# EAGLE design CH-THB (EAGLE 9.6.2)
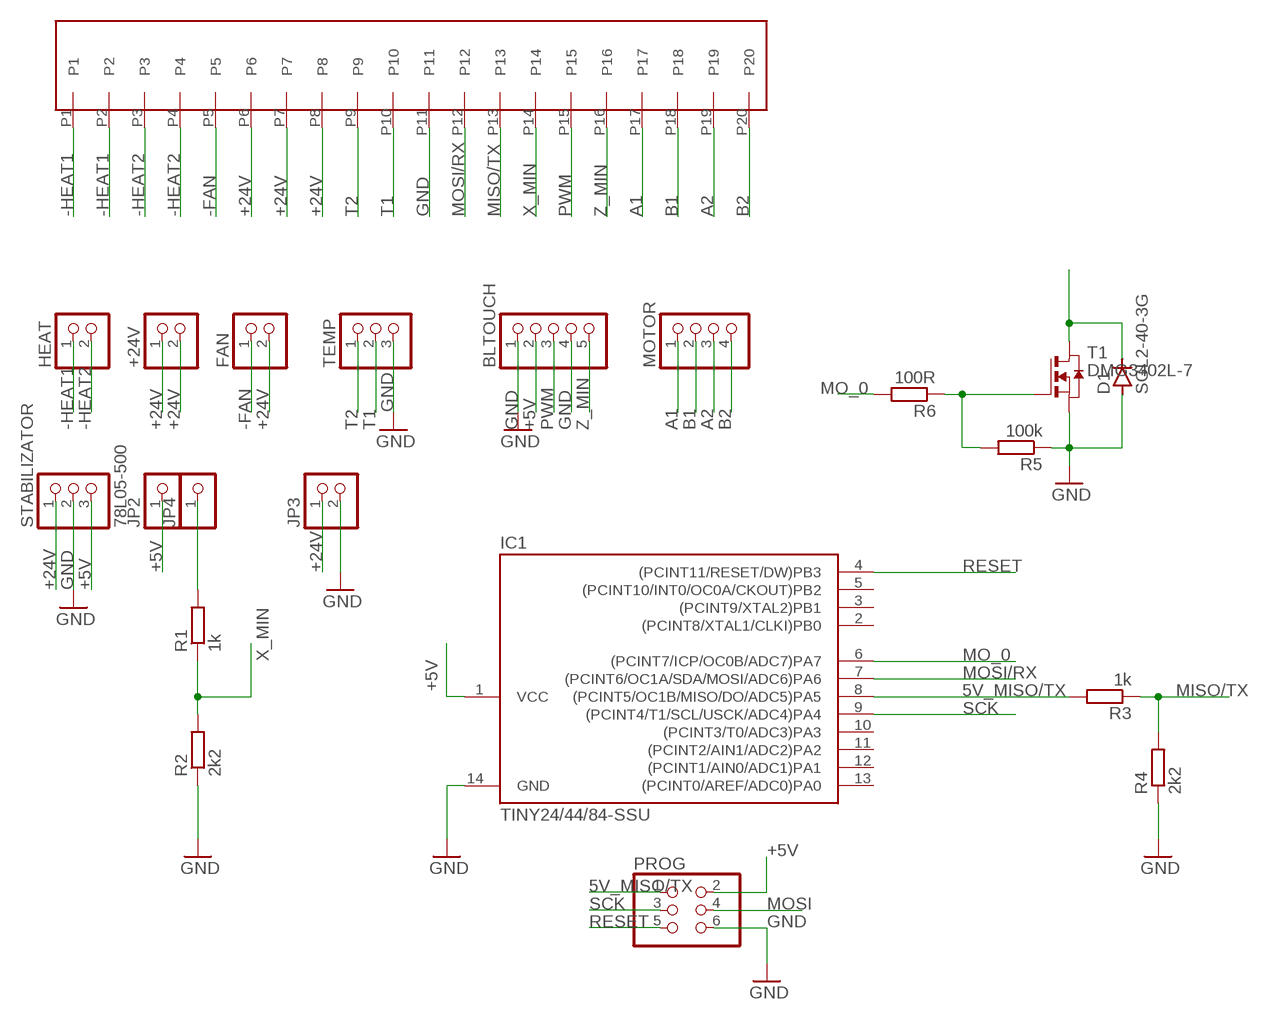
[diagram p0: schematic, sheet 1]

## Parts
+24V  PINHD-1X2/LONG  [1X02]
BLTOUCH  PINHD-1X5/LONG  [1X05]
D1  SGL2-40-3G  D-SOD-80  [SOD80]
FAN  PINHD-1X2/LONG  [1X02]
HEAT  PINHD-1X2/LONG  [1X02]
IC1  TINY24/44/84-SSU  [SOIC14]
JP2  PINHD-1X1/OCT  [1X01/OCT]
JP3  PINHD-1X2/OCT  [1X02/OCT]
JP4  PINHD-1X1/OCT  [1X01/OCT]
MOTOR  PINHD-1X4/LONG  [1X04]
PROG  PINHD-2X3/OCT  [2X03]
R1  1k  R-EU_R0603  [R0603]
R2  2k2  R-EU_R0603  [R0603]
R3  1k  R-EU_R0603  [R0603]
R4  2k2  R-EU_R0603  [R0603]
R5  100k  R-EU_R0603  [R0603]
R6  100R  R-EU_R0603  [R0603]
STABILIZATOR  78L05-500  PINHD-1X3/OCT  [1X03/OCT]
T1  DMG3402L-7  NMOSSOT23  [SOT-23]
TEMP  PINHD-1X3/OCT  [1X03/OCT]
U$1  PL20  [PL20]

## Nets
5V_MISO/TX: IC1.8((PCINT5/OC1B/MISO/DO/ADC5)PA5) PROG.1 R3.2
+5V: BLTOUCH.2 IC1.1(VCC) JP2.1 PROG.2 STABILIZATOR.3
+24V: +24V.1 +24V.2 FAN.2 JP3.1 STABILIZATOR.1 U$1.P6 U$1.P7 U$1.P8
-FAN: FAN.1 U$1.P5
-HEAT1: HEAT.1 U$1.P1 U$1.P2
-HEAT2: HEAT.2 U$1.P3 U$1.P4
A1: MOTOR.1 U$1.P17
A2: MOTOR.3 U$1.P19
B1: MOTOR.2 U$1.P18
B2: MOTOR.4 U$1.P20
GND: BLTOUCH.1 BLTOUCH.4 D1.2(A) IC1.14(GND) JP3.2 PROG.6 R2.1 R4.1 R5.1 STABILIZATOR.2 T1.2(S) TEMP.3 U$1.P11
MISO/TX: R3.1 R4.2 U$1.P13
MO_0: IC1.6((PCINT7/ICP/OC0B/ADC7)PA7) R6.2
MOSI: PROG.4
MOSI/RX: IC1.7((PCINT6/OC1A/SDA/MOSI/ADC6)PA6) U$1.P12
N$1: JP4.1 R1.2
N$3: R5.2 R6.1 T1.3(G)
N$4: D1.1(C) T1.1(D)
PWM: BLTOUCH.3 U$1.P15
RESET: IC1.4((PCINT11/RESET/DW)PB3) PROG.5
SCK: IC1.9((PCINT4/T1/SCL/USCK/ADC4)PA4) PROG.3
T1: TEMP.2 U$1.P10
T2: TEMP.1 U$1.P9
X_MIN: R1.1 R2.2 U$1.P14
Z_MIN: BLTOUCH.5 U$1.P16
Unconnected: IC1.2((PCINT8/XTAL1/CLKI)PB0) IC1.3((PCINT9/XTAL2)PB1) IC1.5((PCINT10/INT0/OC0A/CKOUT)PB2) IC1.10((PCINT3/T0/ADC3)PA3) IC1.11((PCINT2/AIN1/ADC2)PA2) IC1.12((PCINT1/AIN0/ADC1)PA1) IC1.13((PCINT0/AREF/ADC0)PA0)

## Library data of the parts
+24V FAN HEAT JP3 = pinhead_v2:PINHD-1X2: PIN HEADER
BLTOUCH = pinhead_v2:PINHD-1X5: PIN HEADER
D1 = semicon-smd-ipc:D-: DIODE unfilled
IC1 = avr-4:TINY24/44/84
JP2 JP4 = pinhead_v2:PINHD-1X1: PIN HEADER
MOTOR = pinhead_v2:PINHD-1X4: PIN HEADER
PROG = pinhead_v2:PINHD-2X3: PIN HEADER
R1-R6 = rcl:R-EU_: RESISTOR, European symbol; SPICEPREFIX: R
STABILIZATOR TEMP = pinhead_v2:PINHD-1X3: PIN HEADER
T1 = zetex:NMOSSOT23: MOS FET; OC_FARNELL: unknown; OC_NEWARK: unknown
U$1 = Plochy_kabel_Pajeni:PL20

## Board
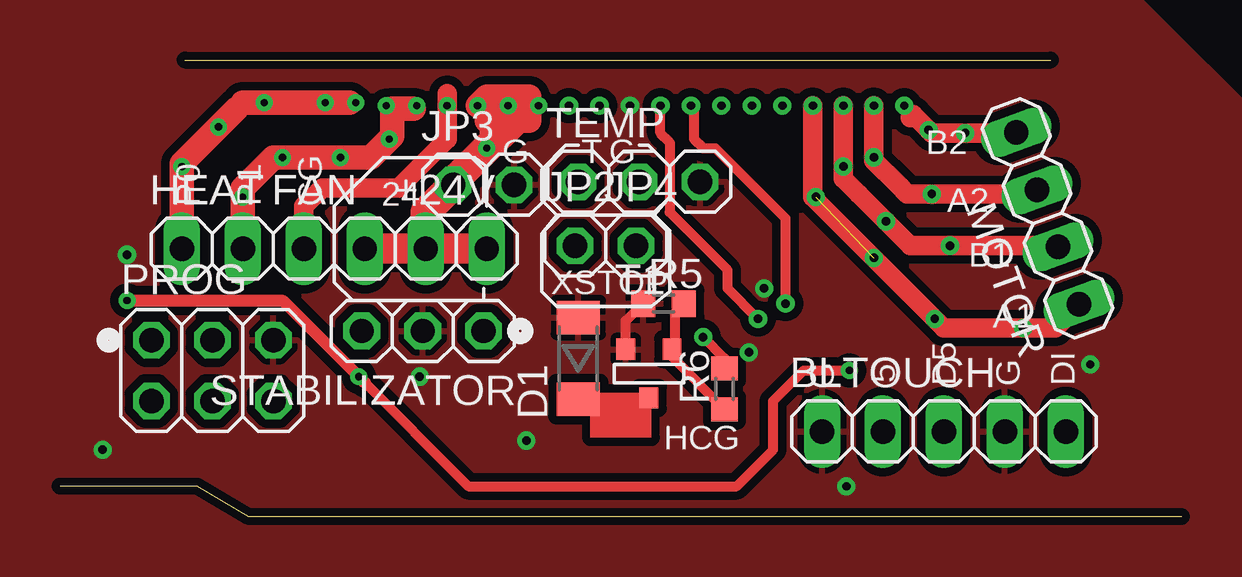
[diagram p1: board, top side]
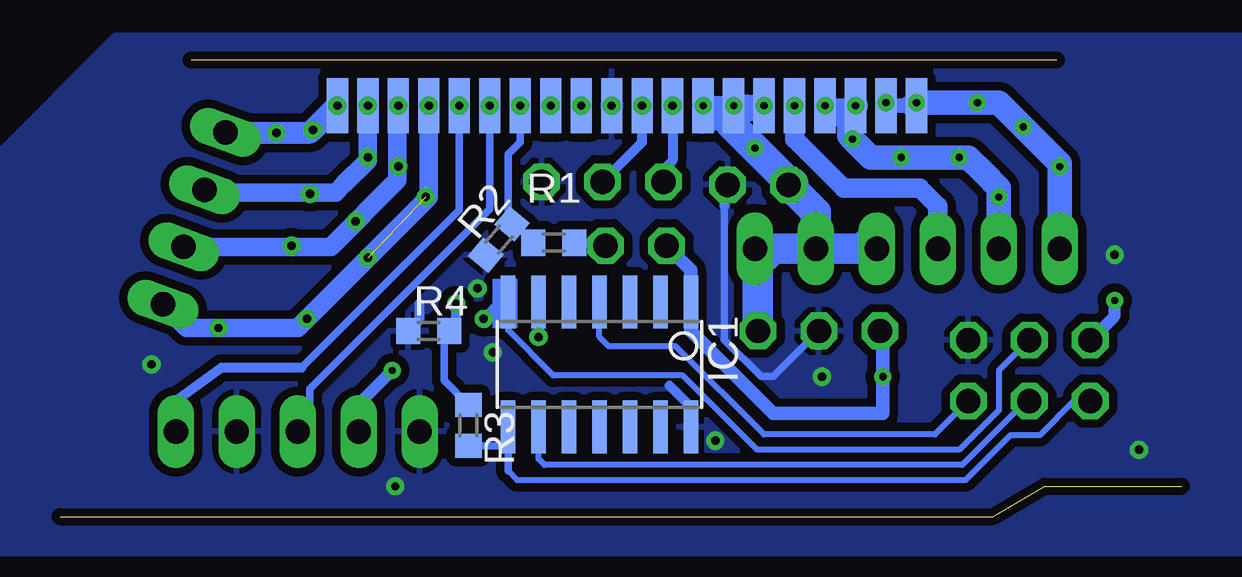
[diagram p2: board, bottom side, seen from below]

Size 46.74 x 19.05 mm. Coordinates in mm from the lower left corner, seen from the top.
Outline: 5.21,19.05 41.27,19.05
Outline: 46.74,0 7.87,0 5.71,1.27 0,1.27
Copper layers (1*16): Top 0.035mm / dielectric 1.5mm / Bottom 0.035mm
Design rules "default *": minimum track width 6mil, minimum drill 0.35mm, track to track 6mil, track to pad 6mil, pad to pad 6mil, via to via 6mil, smd to smd 6mil, copper to edge 10mil, drill to drill 6mil, minimum pad ring 10mil, minimum via ring 8mil, stop-mask expansion 4mil, vias tented up to drill 0mil, thermal gap 10mil

### Footprints (pad centres in the part's own frame; a part is rotated, then mirrored left to right if it is on the bottom)
1X02 = drill 1.016 long: 1 -1.27,0; 2 1.27,0
1X05 = drill 1.016 long: 1 -5.08,0; 2 -2.54,0; 3 0,0; 4 2.54,0; 5 5.08,0
SOD80 = smd 1.4 x 1.8: 1 -1.7,0; 2 1.7,0
SOIC14 = smd 0.61 x 2.21: 1 -3.81,-2.603; 2 -2.54,-2.603; 3 -1.27,-2.603; 4 0,-2.603; 5 1.27,-2.603; 6 2.54,-2.603; 7 3.81,-2.603; 8 3.81,2.603; 9 2.54,2.603; 10 1.27,2.603; 11 0,2.603; 12 -1.27,2.603; 13 -2.54,2.603; 14 -3.81,2.603
1X01/OCT = drill 1.016 octagon: 1 0,0
1X02/OCT = drill 1.016 octagon: 1 -1.27,0; 2 1.27,0
1X04 = drill 1.016 long: 1 -3.81,0; 2 -1.27,0; 3 1.27,0; 4 3.81,0
2X03 = drill 1.016 octagon: 1 -2.54,-1.27; 2 -2.54,1.27; 3 0,-1.27; 4 0,1.27; 5 2.54,-1.27; 6 2.54,1.27
R0603 = smd 1 x 1.1: 1 -0.85,0; 2 0.85,0
1X03/OCT = drill 1.016 octagon: 1 -2.54,0; 2 0,0; 3 2.54,0
SOT-23 = smd 0.787 x 0.889: 1 0.025,-1.016; 2 -0.94,1.016; 3 0.991,1.016
PL20 = smd 0.889 x 2.286: P1 -11.43,0; P2 -10.16,0; P3 -8.89,0; P4 -7.62,0; P5 -6.35,0; P6 -5.08,0; P7 -3.81,0; P8 -2.54,0; P9 -1.27,0; P10 0,0; P11 1.27,0; P12 2.54,0; P13 3.81,0; P14 5.08,0; P15 6.35,0; P16 7.62,0; P17 8.89,0; P18 10.16,0; P19 11.43,0; P20 12.7,0

### Placement (x,y rotation side)
+24V  16.51,11.18 0 top
BLTOUCH  36.83,3.56 0 top
D1  21.59,6.6 90 top
FAN  11.43,11.18 0 top
HEAT  6.35,11.18 0 top
IC1  24.26,6.35 180 bottom
JP2  21.46,11.3 0 top
JP3  17.65,13.84 0 top
JP4  24,11.3 0 top
MOTOR  41.15,12.45 110 top
PROG  6.35,6.1 0 top
R1  26.16,11.43 0 bottom
R2  28.45,11.56 50 bottom
R3  29.72,3.81 270 bottom
R4  31.37,7.75 0 bottom
R5  25.15,8.89 0 top
R6  27.69,5.33 90 top
STABILIZATOR  15.11,7.75 180 top
T1  24.51,5.97 0 top
TEMP  24.13,13.97 0 top
U$1  22.48,17.14 180 bottom

### Tracks (layer width: path | path; a pad name or v marks a point on that pad's centre or on a via)
5V_MISO/TX
  Bottom 0.254: IC1.8 28.07,4.7 | PROG.1 4.5,4.83 5.92,3.4 7.14,3.4 9.02,1.52 27.69,1.52 28.07,1.9
  Bottom 0.305: 28.07,1.9 28.07,2.79 | 28.07,2.79 IC1.8 | R3.2 28.23,2.96 28.07,2.79
+5V  (via drill 0.3)
  Top 0.406: v12.45,5.84 17.02,1.27 28.19,1.27 29.72,2.79 29.72,4.83 30.99,6.1 v32.89,6.1
  Top 0.508: 12.7,5.59 v12.45,5.84 9.27,9.02 v2.79,9.02
  Bottom 0.254: 20.45,7.75 IC1.1 20.32,9.08
  Bottom 0.508: STABILIZATOR.3 12.45,7.62 | v32.89,6.1 34.29,4.7 BLTOUCH.2 | PROG.2 2.79,8.38 v2.79,9.02
  Bottom 0.559: 12.45,7.62 v12.45,5.84 12.45,4.32 17.02,4.32 20.45,7.75 | IC1.1 20.45,10.29 JP2.1
+24V  (via drill 0.3)
  Top 0.61: U$1.P6 18.03,17.14 18.8,16.38 19.05,16.64 | v17.78,15.37 17.78,16.51 17.78,16.64
  Top 1.016: U$1.P6 17.78,17.53 19.56,17.53 19.56,16.51 17.78,16.51
  Top 1.27: +24V.1 15.24,12.7 JP3.1 16.38,13.97 v17.78,15.37 18.8,16.38 | FAN.2 +24V.1 | +24V.1 +24V.2
  Bottom 0.254: JP3.1 16.26,13.97 16.19,13.91
  Bottom 0.559: 18.6,17.07 U$1.P7 18.67,17.18 18.77,17.27 | 18.6,17.07 18.6,16.73 | U$1.P8 19.87,17.07 18.6,17.07 | U$1.P6 18.54,17.14 | +24V.1 17.02,11.18
  Bottom 0.813: 19.96,16.38 18.6,16.73 17.54,17 U$1.P6 18.77,17.27 | 18.54,17.14 U$1.P7 U$1.P8
  Bottom 1.27: +24V.2 15.75,11.18 | 17.02,11.18 17.29,10.9 17.65,11.74 STABILIZATOR.1 | 18.8,16.38 v17.78,15.37 16.32,13.91 | 16.32,13.91 16.45,13.91 15.24,12.7 +24V.1 13.34,11.18 12.7,11.81 | 16.32,13.91 16.19,13.91
  other vias: 17.4,17.14 18.67,17.14 19.94,17.14
-FAN  (via drill 0.3)
  Top 0.813: FAN.1 10.16,12.95 10.92,13.72 14.1,13.72 16.13,15.75 U$1.P5 16.13,17.65
  Bottom 0.813: FAN.1 10.16,12.95 10.92,13.72 14.09,13.72 16.13,15.76 U$1.P5
  other vias: 16.13,17.14
-HEAT1  (via drill 0.3)
  Top 1.016: HEAT.1 5.08,13.46 v5.08,14.61 5.08,14.73 5.84,15.49 v6.6,16.26 7.37,17.02 | 7.62,17.27 v8.51,17.27 9.78,17.27 v11.05,17.27 12.07,17.27
  Bottom 0.61: U$1.P2 U$1.P1
  Bottom 0.813: U$1.P1 11.35,17.17 10.56,17.27
  Bottom 1.016: HEAT.1 5.08,13.46 v5.08,14.61 5.08,14.74 7.62,17.27 v8.51,17.27 9.78,17.27 10.56,17.27
-HEAT2  (via drill 0.3)
  Top 1.016: HEAT.2 v7.62,13.34 7.62,13.72 8.26,14.35 8.89,14.99 v9.27,14.99 10.54,14.99 v11.68,14.99 12.83,14.99 12.95,14.99 v13.72,15.75 13.84,15.88 13.84,17.02 14.73,17.02
  Bottom 0.152: U$1.P4 14.86,17.05 14.6,16.79
  Bottom 0.61: 13.85,16.56 14.6,16.79 | 15.03,16.98 U$1.P4 U$1.P3
  Bottom 1.016: 13.85,16.56 13.85,15.89 v13.72,15.75 12.95,14.99 12.83,14.99 v11.68,14.99 10.54,14.99 v9.27,14.99 8.89,14.99 8.26,14.35 7.62,13.72 v7.62,13.34 HEAT.2 | U$1.P3 13.94,16.79 14.6,16.79
  other vias: 13.59,17.14 14.86,17.14
A1  (via drill 0.35)  (1 unrouted)
  Top 0.813: MOTOR.1 41.46,7.87 36.83,7.87 31.37,13.34 U$1.P17
  Bottom 0.762: U$1.P17 31.37,15.11 31.37,13.34 32.64,12.07 v33.91,10.79 35.18,9.53 v36.45,8.26 36.83,7.87 37.97,7.87 v40.13,7.87 41.46,7.87 MOTOR.1
  other vias: 31.37,17.14 31.5,13.34
A2  (via drill 0.35)
  Top 0.813: U$1.P19 33.91,16.51 33.91,15.75 33.91,14.86 34.92,13.84 35.31,13.46 v36.32,13.46 37.85,13.46 40.54,13.46 MOTOR.3
  Bottom 0.762: U$1.P19 v33.91,14.99 33.91,14.86 34.92,13.84 35.26,13.51 40.59,13.51 MOTOR.3
  other vias: 33.91,17.14
B1  (via drill 0.35)
  Top 0.813: U$1.P18 v32.64,14.61 32.64,14.1 33.27,13.46 v34.42,12.32 35.43,11.3 35.56,11.3 v37.08,11.3 39.12,11.3 40.89,11.3 40.89,10.92
  Bottom 0.762: U$1.P18 32.68,17.11 32.68,14.04 35.46,11.25 MOTOR.2
  other vias: 32.64,17.14
B2  (via drill 0.35)
  Top 0.813: MOTOR.4 39.82,16 v37.72,16 36.32,16 v36.2,16.13 35.56,16.76 35.43,16.64
  Bottom 0.914: U$1.P20 v36.2,16.13 36.3,16.03 MOTOR.4
  other vias: 35.18,17.14
GND  (via drill 0.35)
  Top 0.406: T1.2 23.57,8.17 R5.1
  Bottom 0.305: 19.05,12.95 19.05,7.37 17.53,5.84 17.02,5.84 STABILIZATOR.2
  Bottom 0.406: IC1.14 20.45,4.57 21.34,5.46 | R4.1 31.75,8.22 31.75,8.89 | 19.05,12.95 19.05,13.72 JP3.2
  other vias: 23.75,17.14 28.7,6.86 14.99,5.84 2.79,10.92 42.93,6.35 19.43,3.17 29.34,9.53 32.77,1.27 1.78,2.79
  pour Bottom (isolate 0.356): -3.81,-0.25 -3.81,20.07 44.45,20.07 49.53,14.99 49.53,-1.52 -2.54,-1.52
  pour Top (isolate 0.356): -4.83,21.59 -4.83,-2.29 -4.32,-2.79 50.04,-2.79 51.05,-1.78 51.05,15.49 44.45,22.1 -4.83,22.1
MISO/TX  (via drill 0.35)
  Top 0.406: U$1.P13 26.42,17.02 26.42,15.75 26.8,15.37 27.3,15.37 30.23,12.45 v30.23,8.89
  Bottom 0.305: R3.1 30.73,5.68 30.73,7.33 30.52,7.54 R4.2
  Bottom 0.406: R4.2 30.23,8.04 v30.23,8.89
  other vias: 26.29,17.14
MO_0  (via drill 0.35)
  Top 0.406: v26.8,7.49 27.69,6.6 R6.2
  Bottom 0.406: IC1.6 v26.8,7.49 26.67,7.37
MOSI
  Bottom 0.254: PROG.4 7.62,6.1 7.62,4.45 9.27,2.79 17.69,2.79 20.79,5.89 26.18,5.89 28.07,7.78
MOSI/RX  (via drill 0.35)
  Top 0.406: v29.08,8.26 27.81,9.53 27.81,10.29 25.4,12.7 25.4,15.62 25.02,16 U$1.P12
  Bottom 0.406: IC1.7 28.38,8.95 v29.08,8.26
  other vias: 25.02,17.14
N$1
  Bottom 0.305: JP4.1 24.68,11.3 24.8,11.43 R1.2
N$2  (via drill 0.3)
  other vias: 12.32,17.27
N$3
  Top 0.406: R6.1 25.5,6.67 T1.3 25.5,7.24 25.62,7.35 25.62,8.51 R5.2
N$4
  Top 0.406: D1.1 21.54,4.95 T1.1 23.88,4.29
PWM  (via drill 0.35)
  Bottom 0.305: BLTOUCH.3 36.32,4.06 36.32,5.33 28.83,12.83 U$1.P15
  Bottom 0.406: BLTOUCH.3 36.83,4.26
  other vias: 28.83,17.14
RESET
  Bottom 0.254: PROG.5 10.29,3.43 17.4,3.43 21.08,7.11 23.88,7.11 24.26,7.49 IC1.4
SCK
  Bottom 0.254: PROG.3 6.48,4.83 9.14,2.16 26.54,2.16 26.8,2.41 IC1.9
T1  (via drill 0.35)
  Bottom 0.406: TEMP.2 22.48,15.62 U$1.P10
  other vias: 22.48,17.14
T2  (via drill 0.35)
  Bottom 0.406: TEMP.1 21.59,14.48 21.21,14.86 U$1.P9
  other vias: 21.21,17.14
X_MIN  (via drill 0.35)
  Bottom 0.254: R1.1 27.01,11.6
  Bottom 0.305: U$1.P14 27.56,15.62 28.07,15.11 28.07,12.49 R1.1 27.79,12.21 R2.2
  other vias: 27.56,17.14
Z_MIN  (via drill 0.35)
  Bottom 0.305: 36.67,6.22 30.1,12.79 U$1.P16
  Bottom 0.406: BLTOUCH.5 41.91,4.83 40,6.22 36.67,6.22
  other vias: 30.1,17.14
(copper drawn outside any net)
  shapes: Bottom area x1, Top area x1

### Text on the board
_tsilk: G | T | G | B2 | 24 | P0 | P1 | CG | A2 | B1 | XSTOP | A1 | G | 5 | D5 | G | DI | HCG